# Altium schematic sheet Main.SchDoc
size A4; Author: Qquoc; CompanyName: VKU; DrawnBy: Qquoc; Address1: AN NHƠN-BÌNH ĐỊNH; Revision: V1.0; SheetNumber: 1; SheetTotal: 9
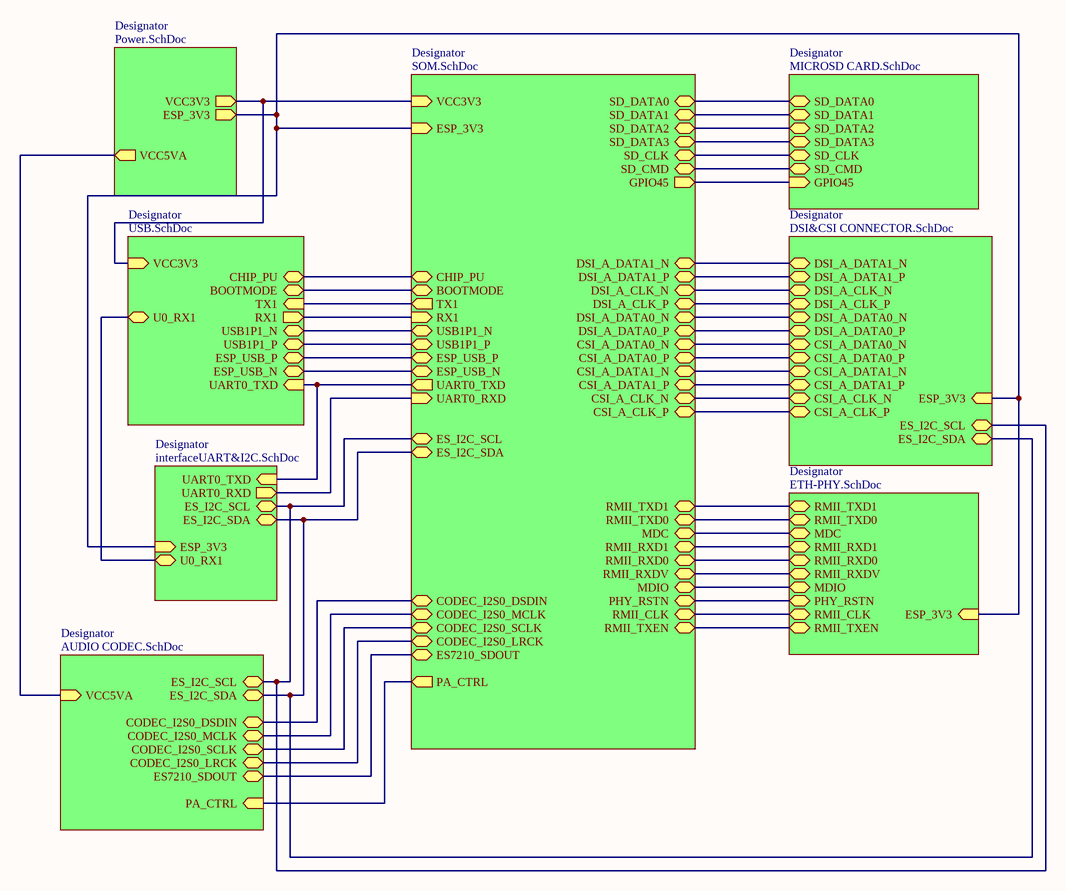
[diagram p0: Main.SchDoc]

## Sub-sheets
Designator = Power.SchDoc: VCC3V3 (out), ESP_3V3 (out), VCC5VA (out)
Designator = interfaceUART&I2C.SchDoc: ESP_3V3 (in), UART0_TXD (in), UART0_RXD (out), ES_I2C_SCL (bidir), ES_I2C_SDA (bidir), U0_RX1 (bidir)
Designator = AUDIO CODEC.SchDoc: VCC5VA (in), PA_CTRL (in), CODEC_I2S0_SCLK (bidir), ES7210_SDOUT (bidir), CODEC_I2S0_LRCK (bidir), CODEC_I2S0_DSDIN (bidir), ES_I2C_SDA (bidir), ES_I2C_SCL (bidir), CODEC_I2S0_MCLK (bidir)
Designator = MICROSD CARD.SchDoc: GPIO45 (in), SD_DATA2 (bidir), SD_DATA3 (bidir), SD_CLK (bidir), SD_DATA0 (bidir), SD_DATA1 (bidir), SD_CMD (bidir)
Designator = USB.SchDoc: VCC3V3 (in), CHIP_PU (bidir), BOOTMODE (bidir), RX1 (out), TX1 (in), USB1P1_N (bidir), USB1P1_P (bidir), ESP_USB_P (bidir), ESP_USB_N (bidir), U0_RX1 (bidir), UART0_TXD (in)
Designator = DSI&CSI CONNECTOR.SchDoc: ES_I2C_SCL (bidir), ES_I2C_SDA (bidir), DSI_A_DATA1_N (bidir), DSI_A_DATA1_P (bidir), DSI_A_CLK_N (bidir), DSI_A_CLK_P (bidir), DSI_A_DATA0_N (bidir), DSI_A_DATA0_P (bidir), ESP_3V3 (in), CSI_A_DATA0_N (bidir), CSI_A_DATA0_P (bidir), CSI_A_DATA1_N (bidir), CSI_A_DATA1_P (bidir), CSI_A_CLK_N (bidir), CSI_A_CLK_P (bidir)
Designator = ETH-PHY.SchDoc: ESP_3V3 (in), RMII_TXEN (bidir), RMII_TXD0 (bidir), RMII_CLK (bidir), RMII_RXDV (bidir), RMII_RXD0 (bidir), RMII_RXD1 (bidir), MDC (bidir), PHY_RSTN (bidir), MDIO (bidir), RMII_TXD1 (bidir)
Designator = SOM.SchDoc: VCC3V3 (in), CHIP_PU (bidir), SD_DATA2 (bidir), SD_DATA3 (bidir), SD_CLK (bidir), SD_CMD (bidir), GPIO45 (out), SD_DATA1 (bidir), SD_DATA0 (bidir), UART0_RXD (in), UART0_TXD (out), BOOTMODE (bidir), RX1 (in), TX1 (out), USB1P1_P (bidir), USB1P1_N (bidir), ESP_USB_P (bidir), ESP_USB_N (bidir), CSI_A_DATA1_P (bidir), CSI_A_DATA1_N (bidir), CSI_A_CLK_N (bidir), CSI_A_CLK_P (bidir), CSI_A_DATA0_P (bidir), CSI_A_DATA0_N (bidir), DSI_A_DATA0_P (bidir), DSI_A_CLK_P (bidir), DSI_A_CLK_N (bidir), DSI_A_DATA1_P (bidir), DSI_A_DATA1_N (bidir), PA_CTRL (out), RMII_TXD1 (bidir), RMII_TXD0 (bidir), MDC (bidir), RMII_RXD1 (bidir), RMII_RXD0 (bidir), RMII_RXDV (bidir), MDIO (bidir), PHY_RSTN (bidir), RMII_CLK (bidir), RMII_TXEN (bidir), ES7210_SDOUT (bidir), CODEC_I2S0_DSDIN (bidir), CODEC_I2S0_MCLK (bidir), CODEC_I2S0_SCLK (bidir), CODEC_I2S0_LRCK (bidir), ES_I2C_SDA (bidir), ES_I2C_SCL (bidir), ESP_3V3 (in), DSI_A_DATA0_N (bidir)

## Nets
(unnamed): sheet Designator/VCC3V3, sheet Designator/VCC3V3, sheet Designator/VCC3V3
(unnamed): sheet Designator/ESP_3V3, sheet Designator/ESP_3V3, sheet Designator/ESP_3V3, sheet Designator/ESP_3V3, sheet Designator/ESP_3V3
(unnamed): sheet Designator/VCC5VA, sheet Designator/VCC5VA
(unnamed): sheet Designator/UART0_TXD, sheet Designator/UART0_TXD, sheet Designator/UART0_TXD
(unnamed): sheet Designator/UART0_RXD, sheet Designator/UART0_RXD
(unnamed): sheet Designator/ES_I2C_SCL, sheet Designator/ES_I2C_SCL, sheet Designator/ES_I2C_SCL, sheet Designator/ES_I2C_SCL
(unnamed): sheet Designator/ES_I2C_SDA, sheet Designator/ES_I2C_SDA, sheet Designator/ES_I2C_SDA, sheet Designator/ES_I2C_SDA
(unnamed): sheet Designator/U0_RX1, sheet Designator/U0_RX1
(unnamed): sheet Designator/PA_CTRL, sheet Designator/PA_CTRL
(unnamed): sheet Designator/CODEC_I2S0_SCLK, sheet Designator/CODEC_I2S0_SCLK
(unnamed): sheet Designator/ES7210_SDOUT, sheet Designator/ES7210_SDOUT
(unnamed): sheet Designator/CODEC_I2S0_LRCK, sheet Designator/CODEC_I2S0_LRCK
(unnamed): sheet Designator/CODEC_I2S0_DSDIN, sheet Designator/CODEC_I2S0_DSDIN
(unnamed): sheet Designator/CODEC_I2S0_MCLK, sheet Designator/CODEC_I2S0_MCLK
(unnamed): sheet Designator/GPIO45, sheet Designator/GPIO45
(unnamed): sheet Designator/SD_DATA2, sheet Designator/SD_DATA2
(unnamed): sheet Designator/SD_DATA3, sheet Designator/SD_DATA3
(unnamed): sheet Designator/SD_CLK, sheet Designator/SD_CLK
(unnamed): sheet Designator/SD_DATA0, sheet Designator/SD_DATA0
(unnamed): sheet Designator/SD_DATA1, sheet Designator/SD_DATA1
(unnamed): sheet Designator/SD_CMD, sheet Designator/SD_CMD
(unnamed): sheet Designator/CHIP_PU, sheet Designator/CHIP_PU
(unnamed): sheet Designator/BOOTMODE, sheet Designator/BOOTMODE
(unnamed): sheet Designator/RX1, sheet Designator/RX1
(unnamed): sheet Designator/TX1, sheet Designator/TX1
(unnamed): sheet Designator/USB1P1_N, sheet Designator/USB1P1_N
(unnamed): sheet Designator/USB1P1_P, sheet Designator/USB1P1_P
(unnamed): sheet Designator/ESP_USB_P, sheet Designator/ESP_USB_P
(unnamed): sheet Designator/ESP_USB_N, sheet Designator/ESP_USB_N
(unnamed): sheet Designator/DSI_A_DATA1_N, sheet Designator/DSI_A_DATA1_N
(unnamed): sheet Designator/DSI_A_DATA1_P, sheet Designator/DSI_A_DATA1_P
(unnamed): sheet Designator/DSI_A_CLK_N, sheet Designator/DSI_A_CLK_N
(unnamed): sheet Designator/DSI_A_CLK_P, sheet Designator/DSI_A_CLK_P
(unnamed): sheet Designator/DSI_A_DATA0_N, sheet Designator/DSI_A_DATA0_N
(unnamed): sheet Designator/DSI_A_DATA0_P, sheet Designator/DSI_A_DATA0_P
(unnamed): sheet Designator/CSI_A_DATA0_N, sheet Designator/CSI_A_DATA0_N
(unnamed): sheet Designator/CSI_A_DATA0_P, sheet Designator/CSI_A_DATA0_P
(unnamed): sheet Designator/CSI_A_DATA1_N, sheet Designator/CSI_A_DATA1_N
(unnamed): sheet Designator/CSI_A_DATA1_P, sheet Designator/CSI_A_DATA1_P
(unnamed): sheet Designator/CSI_A_CLK_N, sheet Designator/CSI_A_CLK_N
(unnamed): sheet Designator/CSI_A_CLK_P, sheet Designator/CSI_A_CLK_P
(unnamed): sheet Designator/RMII_TXEN, sheet Designator/RMII_TXEN
(unnamed): sheet Designator/RMII_TXD0, sheet Designator/RMII_TXD0
(unnamed): sheet Designator/RMII_CLK, sheet Designator/RMII_CLK
(unnamed): sheet Designator/RMII_RXDV, sheet Designator/RMII_RXDV
(unnamed): sheet Designator/RMII_RXD0, sheet Designator/RMII_RXD0
(unnamed): sheet Designator/RMII_RXD1, sheet Designator/RMII_RXD1
(unnamed): sheet Designator/MDC, sheet Designator/MDC
(unnamed): sheet Designator/PHY_RSTN, sheet Designator/PHY_RSTN
(unnamed): sheet Designator/MDIO, sheet Designator/MDIO
(unnamed): sheet Designator/RMII_TXD1, sheet Designator/RMII_TXD1